# EAGLE design engine_controller (EAGLE 5.06)
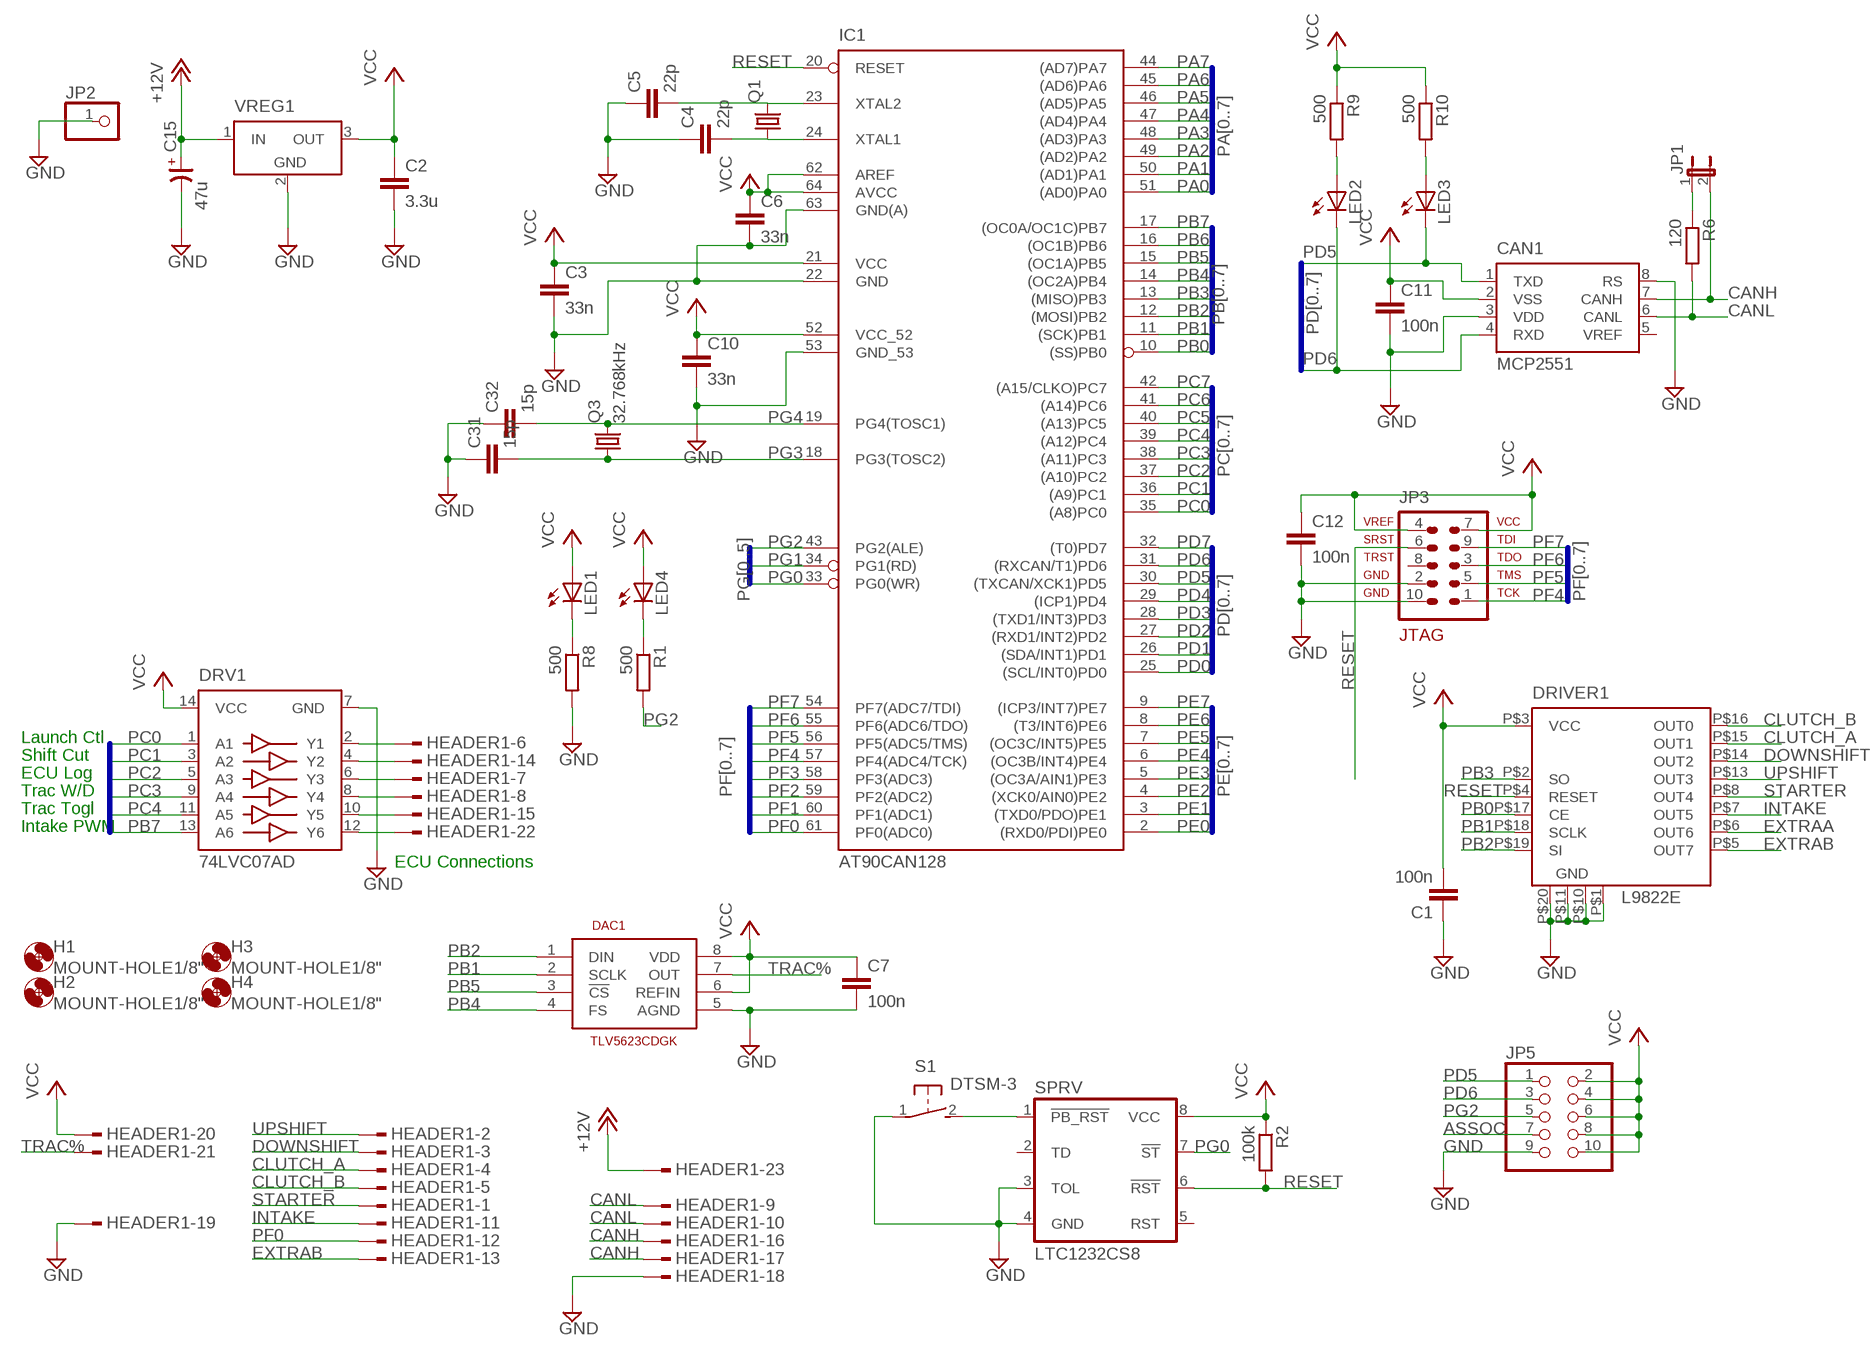
[diagram p0: schematic, sheet 1]

## Parts
C1  100n  C-EUC1206  [C1206]
C2  3.3u  C-EUC1206  [C1206]
C3  33n  C-EUC1206  [C1206]
C4  22p  C-EUC1206  [C1206]
C5  22p  C-EUC1206  [C1206]
C6  33n  C-EUC1206  [C1206]
C7  100n  C-EUC1206  [C1206]
C10  33n  C-EUC1206  [C1206]
C11  100n  C-EUC1206  [C1206]
C12  100n  C-EUC1206  [C1206]
C15  47u  CP-SV-E/F  [SV-E/F]
C31  15p  C-EUC1206  [C1206]
C32  15p  C-EUC1206  [C1206]
CAN1  MCP2551  [SOIC8]
DAC1  TLV5623CDGK  [MSOP08]
DRIVER1  L9822E  [POWERSO-20-NEW]
DRV1  74LVC07AD  [SO14]
H1  MOUNT-HOLE1/8"  [1/8"]
H2  MOUNT-HOLE1/8"  [1/8"]
H3  MOUNT-HOLE1/8"  [1/8"]
H4  MOUNT-HOLE1/8"  [1/8"]
HEADER1  AMPSEAL23-HEADER  [AMPSEAL23-HEADER]
IC1  AT90CAN128  [TQFP64]
JP1  JP1E  [JP1]
JP2  PINHD-1X1  [1X01]
JP3  AVR-JTAG-10  [AVR-JTAG-10]
JP5  PINHD-2X5  [2X05]
LED1  LEDCHIPLED_1206  [CHIPLED_1206]
LED2  LEDCHIPLED_1206  [CHIPLED_1206]
LED3  LEDCHIPLED_1206  [CHIPLED_1206]
LED4  LEDCHIPLED_1206  [CHIPLED_1206]
Q1  CRYSTALHC49UP  [HC49UP]
Q3  32.768kHz  CRYSTALTC26H  [TC26H]
R1  500  R-EU_R1206  [R1206]
R2  100k  R-EU_R1206  [R1206]
R6  120  R-EU_R1206  [R1206]
R8  500  R-EU_R1206  [R1206]
R9  500  R-EU_R1206  [R1206]
R10  500  R-EU_R1206  [R1206]
S1  DTSM-3  [DTSM-3]
SPRV  LTC1232CS8  [SOIC8]
VREG1  LT1129CST5  [SOT223]

## Nets
+12V: C15.+ HEADER1.23 VREG1.1(IN)
ASSOC: JP5.7
CANH: CAN1.7(CANH) HEADER1.16 HEADER1.17 JP1.2
CANL: CAN1.6(CANL) HEADER1.9 HEADER1.10 R6.2
CLUTCH_A: DRIVER1.P$15(OUT1) HEADER1.4
CLUTCH_B: DRIVER1.P$16(OUT0) HEADER1.5
DOWNSHIFT: DRIVER1.P$14(OUT2) HEADER1.3
EXTRAA: DRIVER1.P$6(OUT6)
EXTRAB: DRIVER1.P$5(OUT7) HEADER1.13
GND: C1.1 C2.2 C3.2 C4.1 C5.1 C6.2 C7.2 C10.2 C11.2 C12.2 C15.- C31.1 C32.1 CAN1.3(VDD) CAN1.8(RS) DAC1.5(AGND) DRIVER1.P$1(GND) DRIVER1.P$10(GND1) DRIVER1.P$11(GND2) DRIVER1.P$20(GND3) DRV1.7(GND) HEADER1.18 HEADER1.19 IC1.22(GND) IC1.53(GND_53) IC1.63(GND(A)) JP2.1 JP3.2 JP3.10 JP5.9 R8.2 S1.1 SPRV.3(TOL) SPRV.4(GND) VREG1.2(GND)
INTAKE: DRIVER1.P$7(OUT5) HEADER1.11
N$1: LED4.C R1.1
N$2: DRV1.2(Y1) HEADER1.6
N$3: DRV1.4(Y2) HEADER1.14
N$4: C5.2 IC1.23(XTAL2) Q1.2
N$5: C4.2 IC1.24(XTAL1) Q1.1
N$6: DRV1.6(Y3) HEADER1.7
N$7: DRV1.8(Y4) HEADER1.8
N$8: DRV1.10(Y5) HEADER1.15
N$9: DRV1.12(Y6) HEADER1.22
N$18: S1.2 SPRV.1(!PB_RST)
N$19: JP1.1 R6.1
N$20: LED1.C R8.1
N$21: LED2.A R9.2
N$23: LED3.A R10.2
PA0: IC1.51((AD0)PA0)
PA1: IC1.50((AD1)PA1)
PA2: IC1.49((AD2)PA2)
PA3: IC1.48((AD3)PA3)
PA4: IC1.47((AD4)PA4)
PA5: IC1.46((AD5)PA5)
PA6: IC1.45((AD6)PA6)
PA7: IC1.44((AD7)PA7)
PB0: DRIVER1.P$17(CE) IC1.10((SS)PB0)
PB1: DAC1.2(SCLK) DRIVER1.P$18(SCLK) IC1.11((SCK)PB1)
PB2: DAC1.1(DIN) DRIVER1.P$19(SI) IC1.12((MOSI)PB2)
PB3: DRIVER1.P$2(SO) IC1.13((MISO)PB3)
PB4: DAC1.4(FS) IC1.14((OC2A)PB4)
PB5: DAC1.3(!CS) IC1.15((OC1A)PB5)
PB6: IC1.16((OC1B)PB6)
PB7: DRV1.13(A6) IC1.17((OC0A/OC1C)PB7)
PC0: DRV1.1(A1) IC1.35((A8)PC0)
PC1: DRV1.3(A2) IC1.36((A9)PC1)
PC2: DRV1.5(A3) IC1.37((A10)PC2)
PC3: DRV1.9(A4) IC1.38((A11)PC3)
PC4: DRV1.11(A5) IC1.39((A12)PC4)
PC5: IC1.40((A13)PC5)
PC6: IC1.41((A14)PC6)
PC7: IC1.42((A15/CLKO)PC7)
PD0: IC1.25((SCL/INT0)PD0)
PD1: IC1.26((SDA/INT1)PD1)
PD2: IC1.27((RXD1/INT2)PD2)
PD3: IC1.28((TXD1/INT3)PD3)
PD4: IC1.29((ICP1)PD4)
PD5: CAN1.1(TXD) IC1.30((TXCAN/XCK1)PD5) JP5.1 LED3.C
PD6: CAN1.4(RXD) IC1.31((RXCAN/T1)PD6) JP5.3 LED2.C
PD7: IC1.32((T0)PD7)
PE0: IC1.2((RXD0/PDI)PE0)
PE1: IC1.3((TXD0/PDO)PE1)
PE2: IC1.4((XCK0/AIN0)PE2)
PE3: IC1.5((OC3A/AIN1)PE3)
PE4: IC1.6((OC3B/INT4)PE4)
PE5: IC1.7((OC3C/INT5)PE5)
PE6: IC1.8((T3/INT6)PE6)
PE7: IC1.9((ICP3/INT7)PE7)
PF0: HEADER1.12 IC1.61(PF0(ADC0))
PF1: IC1.60(PF1(ADC1))
PF2: IC1.59(PF2(ADC2))
PF3: IC1.58(PF3(ADC3))
PF4: IC1.57(PF4(ADC4/TCK)) JP3.1
PF5: IC1.56(PF5(ADC5/TMS)) JP3.5
PF6: IC1.55(PF6(ADC6/TDO)) JP3.3
PF7: IC1.54(PF7(ADC7/TDI)) JP3.9
PG0: IC1.33(PG0(WR)) SPRV.7(!ST)
PG1: IC1.34(PG1(RD))
PG2: IC1.43(PG2(ALE)) JP5.5 R1.2
PG3: C31.2 IC1.18(PG3(TOSC2)) Q3.1
PG4: C32.2 IC1.19(PG4(TOSC1)) Q3.2
RESET: DRIVER1.P$4(RESET) IC1.20(RESET) JP3.6 R2.2 SPRV.6(!RST)
STARTER: DRIVER1.P$8(OUT4) HEADER1.1
TRAC%: DAC1.7(OUT) HEADER1.21
UPSHIFT: DRIVER1.P$13(OUT3) HEADER1.2
VCC: C1.2 C2.1 C3.1 C6.1 C7.1 C10.1 C11.1 C12.1 CAN1.2(VSS) DAC1.6(REFIN) DAC1.8(VDD) DRIVER1.P$3(VCC) DRV1.14(VCC) HEADER1.20 IC1.21(VCC) IC1.52(VCC_52) IC1.62(AREF) IC1.64(AVCC) JP3.4 JP3.7 JP5.2 JP5.4 JP5.6 JP5.8 JP5.10 LED1.A LED4.A R2.1 R9.1 R10.1 SPRV.8(VCC) VREG1.3(OUT)
Unconnected: JP3.8 SPRV.2(TD) SPRV.5(RST)

## Buses
PD[0..7]
PF[0..7]
PE[0..7]
PB[0..7]
PA[0..7]
PC[0..7]
PG[0..5]

## Notes on the sheet
- Launch Ctl
- Shift Cut
- ECU Log
- Trac W/D
- Trac Togl
- Intake PWM
- ECU Connections

## Power pins joined to a net without a drawn wire
GND: VREG1.4(GND)
VREF: CAN1.5(VREF)

## Library data of the parts
C1-C7 C10-C12 C31 C32 = resistor:C-EU: CAPACITOR, European symbol
C15 = cap-master:CP-: POLARIZED CAP
CAN1 = MCP2551:MCP2551
DAC1 = tlv5623:TLV5623: LOW POWER 8-BIT DIGITAL-TO-ANALOG CONVERTERS WITH POWER DOWN
DRIVER1 = st-microelectronics:L9822E: The L9822E is an octal low-side solenoid driver realized in Multipower BCD technology particularly suited for driving lamps, relays and solenoids in automotive environment. The DMOS outputs L9822E has a very low power consumption.
DRV1 = 74LVC:74LVC07A: Hex buffer with open-drain outputs
H1-H4 = holes:MOUNT-HOLE: MOUNTING HOLE with drill center marker
HEADER1 = ampseal:AMPSEAL23-HEADER: HEADER ASSEMBLY, 23 POSITION, SNAP-IN, AMPSEAL
IC1 = at90can128:AT90CAN128
JP1 = jumper:JP1E: JUMPER
JP2 = pinhead:PINHD-1X1: PIN HEADER
JP3 = atmel:AVR-JTAG-10: AVR JTAG Debug/Programming Header
JP5 = pinhead:PINHD-2X5: PIN HEADER
LED1-LED4 = led:LED: LED OSRAM: - CHIPLED LG R971, LG N971, LY N971, LG Q971, LY Q971, LO R971, LY R971 LH N974, LH R974 LS Q976, LO Q976, LY Q976 LO Q996 - Hyper CHIPLED LW Q18S LB Q993, LB Q99A, LB R99A - SideLED LS A670, LO A670, LY A670, LG A670, LP A670 LB A673, LV A673, LT A673, LW A673 LH A674 LY A675 LS A676, LA A676, LO A676, LY A676, LW A676 LS A679, LY A679, LG A679 - Hyper Micro SIDELED® LS Y876, LA Y876, LO Y876, LY Y876 LT Y87S - SmartLED LW L88C, LW L88S LB L89C, LB L89S, LG L890 LS L89K, LO L89K, LY L89K LS L896, LA L896, LO L896, LY L896 - TOPLED LS T670, LO T670, LY T670, LG T670, LP T670 LSG T670, LSP T670, LSY T670, LOP T670, LYG T670 LG T671, LOG T671, LSG T671 LB T673, LV T673, LT T673, LW T673 LH T674 LS T676, LA T676, LO T676, LY T676, LB T676, LH T676, LSB T676, LW T676 LB T67C, LV T67C, LT T67C, LS T67K, LO T67K, LY T67K, LW E67C LS E67B, LA E67B, LO E67B, LY E67B, LB E67C, LV E67C, LT E67C LW T67C LS T679, LY T679, LG T679 LS T770, LO T770, LY T770, LG T770, LP T770 LB T773, LV T773, LT T773, LW T773 LH T774 LS E675, LA E675, LY E675, LS T675 LS T776, LA T776, LO T776, LY T776, LB T776 LHGB T686 LT T68C, LB T68C - Hyper Mini TOPLED® LB M676 - Mini TOPLED Santana® LG M470 LS M47K, LO M47K, LY M47K Source: http://www.osram.convergy.de LUXEON: - LUMILED® LXK2-PW12-R00, LXK2-PW12-S00, LXK2-PW14-U00, LXK2-PW14-V00 LXK2-PM12-R00, LXK2-PM12-S00, LXK2-PM14-U00 LXK2-PE12-Q00, LXK2-PE12-R00, LXK2-PE12-S00, LXK2-PE14-T00, LXK2-PE14-U00 LXK2-PB12-K00, LXK2-PB12-L00, LXK2-PB12-M00, LXK2-PB14-N00, LXK2-PB14-P00, LXK2-PB14-Q00 LXK2-PR12-L00, LXK2-PR12-M00, LXK2-PR14-Q00, LXK2-PR14-R00 LXK2-PD12-Q00, LXK2-PD12-R00, LXK2-PD12-S00 LXK2-PH12-R00, LXK2-PH12-S00 LXK2-PL12-P00, LXK2-PL12-Q00, LXK2-PL12-R00 Source: www.luxeon.com KINGBRIGHT: KA-3528ASYC Source: www.kingbright.com
Q1 Q3 = crystal:CRYSTAL: CRYSTAL
R1 R2 R6 R8-R10 = resistor:R-EU_: RESISTOR, European symbol
S1 = switch-tact:DTSM-3
SPRV = linear:LTC1232: Microprocessor Supervisory Circuit
VREG1 = linear-technology:LT1129CST5: VOLTAGE REGULATOR with shutdown

## Board
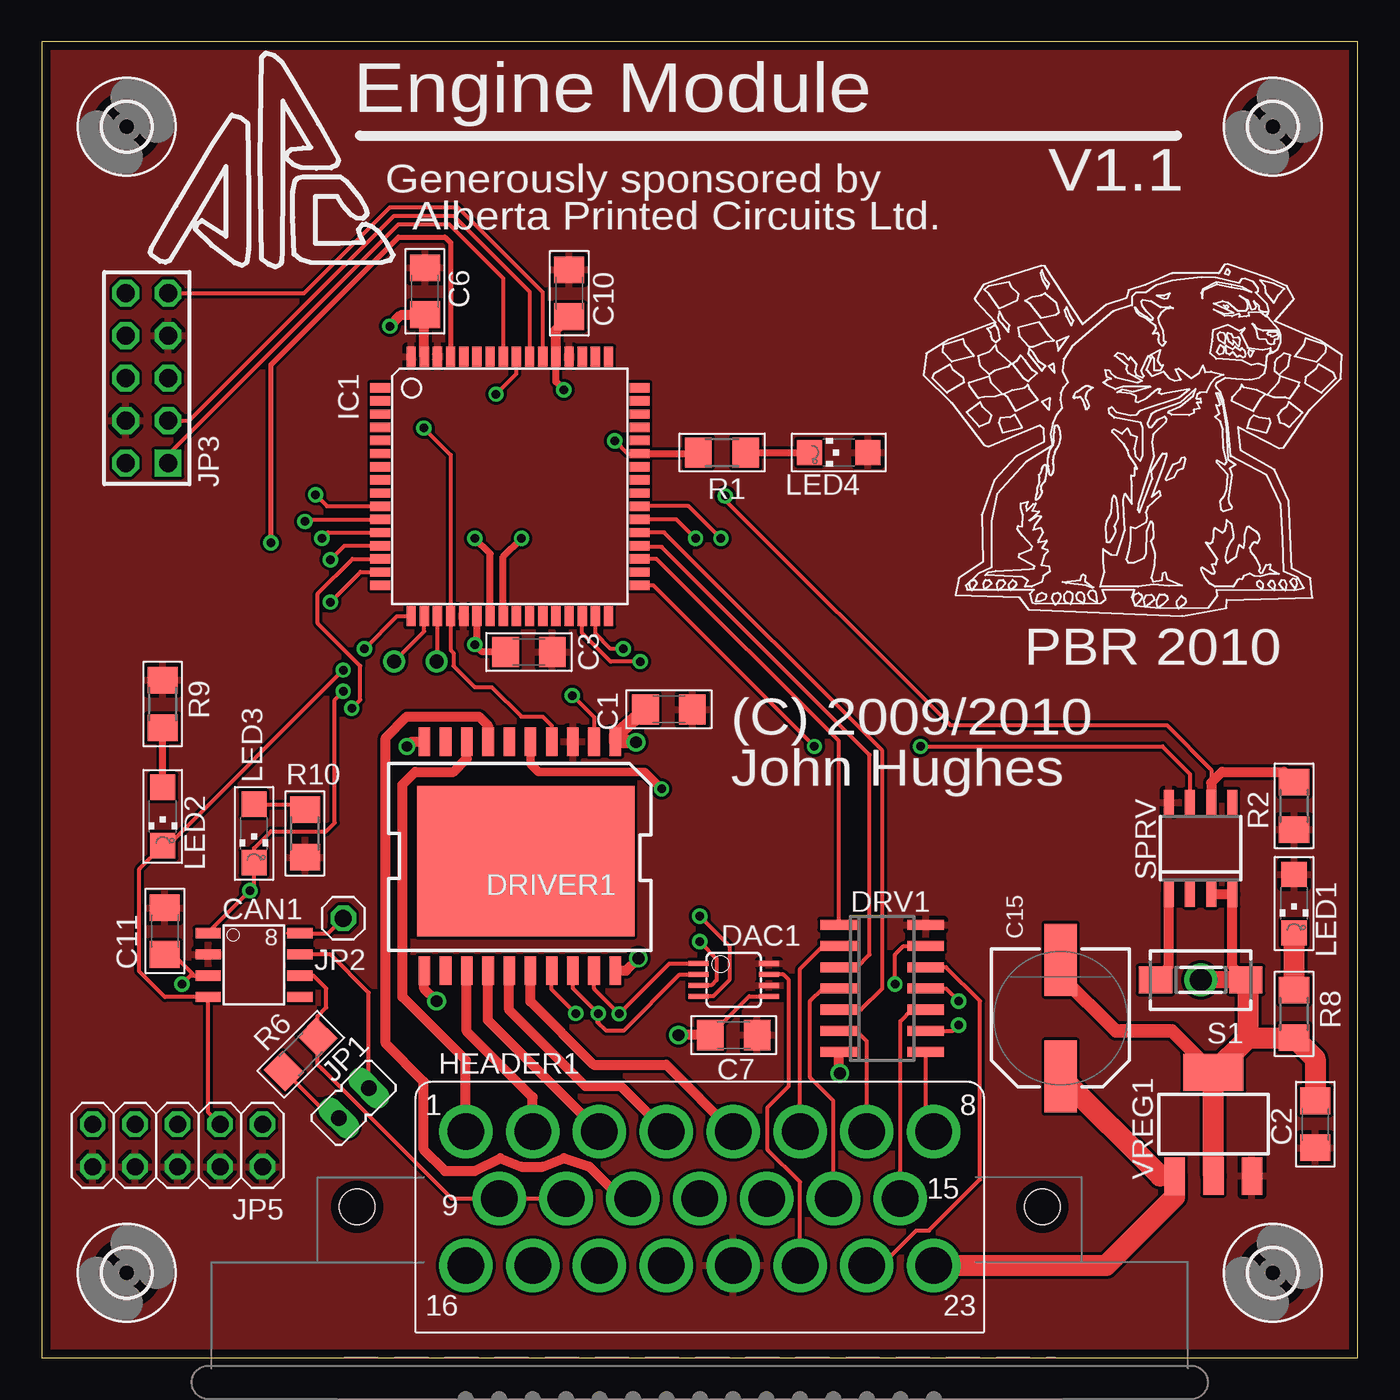
[diagram p1: board, top side]
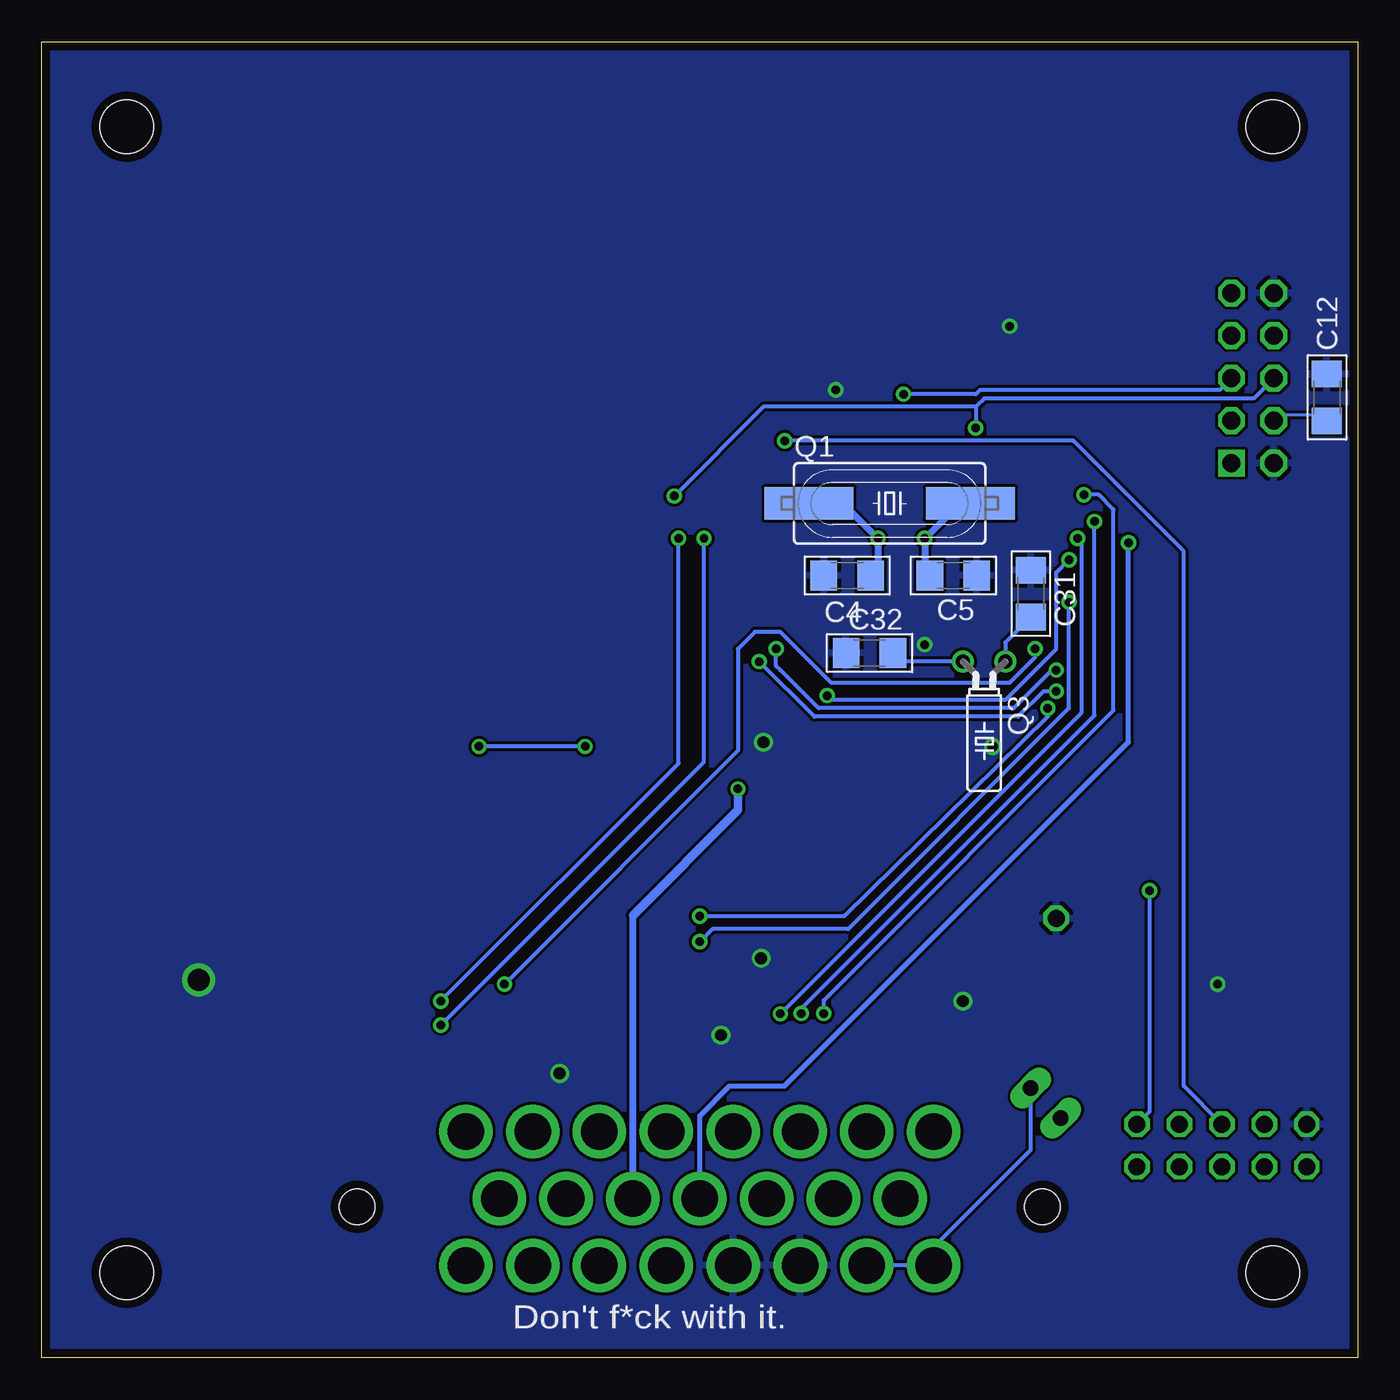
[diagram p2: board, bottom side, seen from below]

Size 78.74 x 78.74 mm. Coordinates in mm from the lower left corner, seen from the top.
Outline: 0,0 78.74,0 78.74,78.74 0,78.74 0,0
Copper layers (1*16): Top 0.035mm / dielectric 1.5mm / Bottom 0.035mm
Design rules "APCircuits": minimum track width 7mil, minimum drill 16mil, track to track 7mil, track to pad 7mil, pad to pad 7mil, via to via 7mil, smd to smd 7mil, copper to edge 20mil, drill to drill 7mil, minimum pad ring 10mil, minimum via ring 8mil, stop-mask expansion 4mil, vias tented up to drill 0mil, thermal gap 10mil

### Footprints (pad centres in the part's own frame; a part is rotated, then mirrored left to right if it is on the bottom)
C1206 = smd 1.6 x 1.8: 1 -1.4,0; 2 1.4,0
SV-E/F = smd 4.318 x 1.93: + -3.493,0; - 3.493,0
SOIC8 = smd 0.61 x 1.524: 1 -2.54,-2.743; 2 -1.27,-2.743; 3 0,-2.743; 4 1.27,-2.743; 5 1.27,2.743; 6 0,2.743; 7 -1.27,2.743; 8 -2.54,2.743
MSOP08 = smd 0.3 x 1.2: 1 -0.976,-2.113; 2 -0.326,-2.113; 3 0.324,-2.113; 4 0.974,-2.113; 5 0.974,2.112; 6 0.324,2.112; 7 -0.326,2.112; 8 -0.976,2.112
POWERSO-20-NEW = smd 0.7 x 1.7: P$1 -2.315,-7.15; P$2 -1.045,-7.15; P$3 0.225,-7.15; P$4 1.495,-7.15; P$5 2.765,-7.15; P$6 4.035,-7.15; P$7 5.305,-7.15; P$8 6.575,-7.15; P$9 7.845,-7.15; P$10 9.115,-7.15; P$11 9.115,6.55; P$12 7.845,6.55; P$13 6.575,6.55; P$14 5.305,6.55; P$15 4.035,6.55; P$16 2.765,6.55; P$17 1.495,6.55; P$18 0.225,6.55; P$19 -1.045,6.55; P$20 -2.315,6.55 | smd 13 x 9: THERMAL 3.05,0
SO14 = smd 0.6 x 2.2: 1 -3.81,-2.6; 2 -2.54,-2.6; 3 -1.27,-2.6; 4 0,-2.6; 5 1.27,-2.6; 6 2.54,-2.6; 7 3.81,-2.6; 8 3.81,2.6; 9 2.54,2.6; 10 1.27,2.6; 11 0,2.6; 12 -1.27,2.6; 13 -2.54,2.6; 14 -3.81,2.6
1/8" = hole 3.175: 0,0
AMPSEAL23-HEADER = drill 2.184 round: 1 -14,4; 2 -10,4; 3 -6,4; 4 -2,4; 5 2,4; 6 6,4; 7 10,4; 8 14,4; 9 -12,0; 10 -8,0; 11 -4,0; 12 0,0; 13 4,0; 14 8,0; 15 12,0; 16 -14,-4; 17 -10,-4; 18 -6,-4; 19 -2,-4; 20 2,-4; 21 6,-4; 22 10,-4; 23 14,-4 | hole 2.108: -20.5,-0.5; 20.5,-0.5
TQFP64 = smd 1.194 x 0.559: 1 -7.76,5.905; 2 -7.76,5.118; 3 -7.76,4.331; 4 -7.76,3.543; 5 -7.76,2.756; 6 -7.76,1.968; 7 -7.76,1.181; 8 -7.76,0.394; 9 -7.76,-0.394; 10 -7.76,-1.181; 11 -7.76,-1.968; 12 -7.76,-2.756; 13 -7.76,-3.543; 14 -7.76,-4.331; 15 -7.76,-5.118; 16 -7.76,-5.905; 33 7.76,-5.905; 34 7.76,-5.118; 35 7.76,-4.331; 36 7.76,-3.543; 37 7.76,-2.756; 38 7.76,-1.968; 39 7.76,-1.181; 40 7.76,-0.394; 41 7.76,0.394; 42 7.76,1.181; 43 7.76,1.968; 44 7.76,2.756; 45 7.76,3.543; 46 7.76,4.331; 47 7.76,5.118; 48 7.76,5.905 | smd 0.559 x 1.194: 17 -5.905,-7.76; 18 -5.118,-7.76; 19 -4.331,-7.76; 20 -3.543,-7.76; 21 -2.756,-7.76; 22 -1.968,-7.76; 23 -1.181,-7.76; 24 -0.394,-7.76; 25 0.394,-7.76; 26 1.181,-7.76; 27 1.968,-7.76; 28 2.756,-7.76; 29 3.543,-7.76; 30 4.331,-7.76; 31 5.118,-7.76; 32 5.905,-7.76; 49 5.905,7.76; 50 5.118,7.76; 51 4.331,7.76; 52 3.543,7.76; 53 2.756,7.76; 54 1.968,7.76; 55 1.181,7.76; 56 0.394,7.76; 57 -0.394,7.76; 58 -1.181,7.76; 59 -1.968,7.76; 60 -2.756,7.76; 61 -3.543,7.76; 62 -4.331,7.76; 63 -5.118,7.76; 64 -5.905,7.76
JP1 = drill 0.914 long: 1 0,-1.27; 2 0,1.27
1X01 = drill 1.016 octagon: 1 0,0
AVR-JTAG-10 = drill 1.067 square: 1 -5.08,-1.27 | drill 1.067 octagon: 2 -5.08,1.27; 3 -2.54,-1.27; 4 -2.54,1.27; 5 0,-1.27; 6 0,1.27; 7 2.54,-1.27; 8 2.54,1.27; 9 5.08,-1.27; 10 5.08,1.27
2X05 = drill 1.016 octagon: 1 -5.08,-1.27; 2 -5.08,1.27; 3 -2.54,-1.27; 4 -2.54,1.27; 5 0,-1.27; 6 0,1.27; 7 2.54,-1.27; 8 2.54,1.27; 9 5.08,-1.27; 10 5.08,1.27
CHIPLED_1206 = smd 1.5 x 1.5: A 0,-1.75; C 0,1.75
HC49UP = smd 5.334 x 1.93: 1 -4.826,0; 2 4.826,0
TC26H = drill 0.813 round: 1 -1.27,0; 2 1.27,0
R1206 = smd 1.6 x 1.803: 1 -1.422,0; 2 1.422,0
DTSM-3 = smd 2 x 1.6: 1 -2.7,0; 2 2.7,0
SOIC8' = smd 0.6 x 1.5: 1 -1.905,-2.75; 2 -0.635,-2.75; 3 0.635,-2.75; 4 1.905,-2.75; 5 1.905,2.75; 6 0.635,2.75; 7 -0.635,2.75; 8 -1.905,2.75
SOT223 = smd 1.219 x 2.235: 1 -2.311,-3.099; 2 0,-3.099; 3 2.311,-3.099 | smd 3.6 x 2.2: 4 0,3.099

### Placement (x,y rotation side)
C1  37.53,38.8 0 top
C2  76.2,13.97 90 top
C3  29.14,42.23 180 top
C4  30.55,46.8 0 bottom
C5  24.2,46.8 180 bottom
C6  22.92,63.81 270 top
C7  41.4,19.3 180 top
C10  31.56,63.69 270 top
C11  7.37,25.53 270 top
C12  1.84,57.47 90 bottom
C15  60.96,20.32 90 top
C31  19.56,45.72 270 bottom
C32  29.21,42.16 0 bottom
CAN1  12.7,22.86 270 top
DAC1  41.4,22.61 270 top
DRIVER1  32,29.72 180 top
DRV1  50.29,22.1 270 top
H1  5.08,5.08 0 top
H2  73.66,5.08 0 top
H3  5.08,73.66 0 top
H4  73.66,73.66 0 top
HEADER1  39.37,9.53 0 top
IC1  28.01,52.13 0 top
JP1  18.67,15.24 315 top
JP2  18.03,26.29 180 top
JP3  6.29,58.61 90 top
JP5  8.13,12.7 180 top
LED1  74.93,27.18 180 top
LED2  7.24,32.38 180 top
LED3  12.7,31.37 180 top
LED4  47.69,54.17 90 top
Q1  28.01,51.12 0 bottom
Q3  22.35,41.66 180 bottom
R1  40.71,54.17 180 top
R2  74.93,33.02 90 top
R6  15.49,18.16 45 top
R8  74.93,20.57 270 top
R9  7.24,39.12 270 top
R10  15.75,31.37 90 top
S1  69.34,22.61 180 top
SPRV  LTC1232CS8  [SOIC8']  69.34,30.48 0 top
VREG1  70.1,13.97 0 top

### Tracks (layer width: path | path; a pad name or v marks a point on that pad's centre or on a via)
+12V
  Top 1.27: HEADER1.23 63.69,5.53 67.79,9.63 VREG1.1 66.92,10.87 C15.+
CANH
  Top 0.254: JP1.2 19.57,21.84 17.27,24.13 CAN1.7
  Bottom 0.254: JP1.2 19.57,12.44 25.37,6.63 HEADER1.16 HEADER1.17
CANL
  Top 0.254: CAN1.6 16.26,22.86 17.02,22.1 17.02,20.95 16.5,20.44 R6.2 16.5,17.54 16.76,17.27 24.51,9.53 HEADER1.9 HEADER1.10
CLUTCH_A
  Top 0.61: DRIVER1.P$15 27.97,20.8 32.51,16.26 34.64,16.26 HEADER1.4
CLUTCH_B
  Top 0.61: DRIVER1.P$16 29.24,21.31 33.02,17.53 37.37,17.53 HEADER1.5
DOWNSHIFT
  Top 0.61: DRIVER1.P$14 26.7,20.2 HEADER1.3
EXTRAB  (via drill 0.51)
  Top 0.508: DRIVER1.P$5 29.24,35.53 29.72,35.05 36.07,35.05 v37.08,34.04
  Bottom 0.406: HEADER1.13 43.37,26.48
  Bottom 0.508: v37.08,34.04 37.08,32.77 43.37,26.48
GND  (via drill 0.51, 0.51 pad 0.61, 0.6 pad 0.61, 0.71, 1.32)
  Top 0.254: DAC1.5 42.33,21.63 C7.2 | JP2.1 17.14,25.4 CAN1.8 14.73,25.4 | 9.14,22.86 8.89,22.86 v8.38,22.35 | 9.14,22.86 CAN1.3 | C11.2 7.88,24.13 9.14,22.86
  Top 0.406: IC1.53 30.76,58.39 v31.24,57.91 | IC1.22 26.04,42.8 v25.91,42.67 26.35,42.23 C3.2
  Top 0.61: DRIVER1.P$20 34.97,23.17 v35.7,23.9 | DRV1.7 47.69,17.33 v47.75,17.02 | S1.1 71.25,23.4 SPRV.4 SPRV.3 | DRIVER1.P$10 22.14,36.87 v21.84,36.58 | C10.2 30.76,61.49 IC1.53 | DRIVER1.P$11 22.89,22.07 v23.62,21.34 | C7.2 v38.1,19.3 | IC1.63 22.89,62.38 | 22.89,62.38 C6.2 | 22.89,62.38 21.48,62.38 v20.83,61.72
  Top 0.813: v35.56,36.83 35.01,36.87 DRIVER1.P$1 34.32,37.23 C1.1 | C15.- 60.96,22.86 64.26,19.56 67.61,19.56 VREG1.4
  Top 1.016: v69.34,22.61 71.68,22.61 72.19,22.1
  Top 1.27: VREG1.2 VREG1.4 72.19,19.15 | 72.19,19.15 R8.2 76.2,17.88 C2.2 | 72.19,19.15 72.19,22.1 72.19,22.46 S1.1
  pour Bottom: 0,78.74 78.74,78.74 78.74,0 0,0
INTAKE
  Top 0.61: DRIVER1.P$7 26.7,37.82 26.16,38.35 21.84,38.35 20.57,37.08 20.57,18.8 22.86,16.51 22.86,12.45 24.13,11.18 25.91,11.18 27.43,11.94 28.7,11.43 29.97,11.43 31.24,11.94 32.77,11.43 34.67,9.53 HEADER1.11
N$1
  Top 0.406: R1.1 LED4.C
N$2
  Top 0.254: HEADER1.6 45.37,23.27 46.74,24.64 DRV1.2
N$3
  Top 0.254: HEADER1.14 47.37,15.37 45.97,16.76 45.97,21.34 46.74,22.1 DRV1.4
N$4  (via drill 0.51)
  Top 0.406: IC1.23 26.82,48.1 v25.91,49.02
  Bottom 0.406: C5.2 25.91,46.35 v25.91,49.02 23.81,51.12 Q1.2
N$5  (via drill 0.51)
  Top 0.406: IC1.24 27.61,47.93 v28.7,49.02
  Bottom 0.406: C4.2 28.7,46.48 v28.7,49.02 30.8,51.12 Q1.1
N$6
  Top 0.254: DRV1.6 48.74,19.56 49.37,18.93 HEADER1.7
N$7
  Top 0.254: DRV1.8 52.89,14 HEADER1.8
N$8
  Top 0.254: HEADER1.15 51.37,20.13 52.07,20.83 DRV1.10
N$9
  Top 0.254: DRV1.12 54.1,23.37 56.13,21.34 56.13,10.67 53.09,7.62 52.32,7.62 50.23,5.53 HEADER1.22
N$18
  Top 0.61: SPRV.1 67.44,23.4 S1.2
N$19
  Top 0.254: R6.1 17.3,14.34
  Top 0.406: 17.3,14.34 JP1.1
N$20
  Top 1.27: R8.1 LED1.C
N$21
  Top 0.406: LED2.A R9.2
N$23
  Top 0.254: LED3.A 14.91,33.12 R10.2
PB0  (via drill 0.51)
  Top 0.254: DRIVER1.P$17 30.51,22.04 v31.95,20.6 | IC1.10 17.07,50.95 v16.39,51.64
  Bottom 0.254: v16.39,51.64 15.49,51.64 14.61,50.75 14.61,38.73 31.95,21.39 v31.95,20.6
PB1  (via drill 0.51)
  Top 0.254: DRIVER1.P$18 31.78,22.11 v33.29,20.6 | 33.29,20.05 33.78,19.56 34.8,19.56 38.17,22.93 DAC1.2 | IC1.11 15.88,50.17 v15.75,50.04
  Top 0.305: 33.29,20.05 v33.29,20.6
  Bottom 0.254: v33.29,20.6 33.29,20.9 15.75,38.44 v15.75,50.04
PB2  (via drill 0.51)
  Top 0.254: IC1.12 17.12,49.38 v16.76,49.02 | DRIVER1.P$19 33.05,22.07 v34.54,20.57 37.55,23.58 DAC1.1
  Bottom 0.254: v34.54,20.57 16.51,38.61 16.51,48.77 v16.76,49.02
PB3  (via drill 0.51)
  Top 0.254: IC1.13 18.11,48.59 v17.27,47.75 | DRIVER1.P$2 33.05,38.33 v31.75,39.62
  Bottom 0.254: v17.27,47.75 18.03,46.99 18.03,42.42 21.08,39.37 31.5,39.37 v31.75,39.62
PB4  (via drill 0.51)
  Top 0.254: DAC1.4 40.17,21.63 41.15,22.61 41.15,24.64 v39.37,26.42 | IC1.14 18.59,47.8 16.51,45.72 16.51,43.94 19.05,41.4 19.05,39.37 v18.54,38.86
  Bottom 0.254: v18.54,38.86 18.54,38.35 30.73,26.42 v39.37,26.42
PB5  (via drill 0.51)
  Top 0.254: DAC1.3 40.06,22.28 40.39,22.61 40.39,23.88 v39.37,24.89 | IC1.15 19.08,47.02 v17.27,45.21
  Bottom 0.254: v17.27,45.21 17.27,38.86 30.48,25.65 38.61,25.65 v39.37,24.89
PB7  (via drill 0.51)
  Top 0.254: DRV1.13 51.56,24.64 51.05,24.13 v51.05,22.35 | IC1.17 21.26,44.37 v19.3,42.42
  Bottom 0.254: v51.05,22.35 37.08,36.32 37.08,42.42 36.07,43.43 34.54,43.43 31.5,40.39 20.83,40.39 19.3,41.91 v19.3,42.42
PC0
  Top 0.254: IC1.35 36.78,47.8 47.69,36.89 DRV1.1
PC1
  Top 0.254: DRV1.3 48.77,23.37 49.53,24.13 49.53,36.07 37.08,48.51 35.84,48.51
  Top 0.406: 35.84,48.51 IC1.36
PC2
  Top 0.254: DRV1.5 49.02,20.83 50.29,22.1 50.29,36.32 37.24,49.38 IC1.37
PC3  (via drill 0.51)
  Top 0.254: IC1.38 37.97,50.17 v39.12,49.02 | DRV1.9 54.5,19.56 v54.85,19.91
  Bottom 0.254: v39.12,49.02 39.12,35.65 v54.85,19.91
PC4  (via drill 0.51)
  Top 0.254: IC1.39 38.71,50.95 v40.64,49.02 | DRV1.11 54.1,22.1 v54.86,21.34
  Bottom 0.254: v40.64,49.02 40.64,35.56 v54.86,21.34
PD5  (via drill 0.51)
  Top 0.254: 10.01,25.5 v12.45,27.94 12.7,28.19 LED3.C 12.7,30.48 13.72,31.5 17.02,31.5 17.53,32 17.53,39.37 v18.03,39.88 | v35.81,41.66 34.04,41.66 32.34,43.35 IC1.30
  Top 0.406: CAN1.1 10.01,25.4 10.01,25.5
  Bottom 0.254: v12.45,27.94 12.45,14.73 JP5.1 | v35.81,41.66 32.51,38.35 20.32,38.35 18.8,39.88 v18.03,39.88
PD6  (via drill 0.51)
  Top 0.254: JP5.3 9.96,14.68 CAN1.4 7.37,21.59 5.84,23.11 5.84,29.24 LED2.C 7.52,30.64 v18.03,41.15 | v34.8,42.42 34.04,42.42 33.12,43.33 IC1.31
  Bottom 0.254: v34.8,42.42 34.8,41.4 34.54,41.15 32.26,38.86 20.57,38.86 18.29,41.15 v18.03,41.15
PF0  (via drill 0.51)
  Top 0.305: IC1.61 24.46,66.72 24.13,67.06 21.34,67.06 13.72,59.44 v13.72,48.77
  Bottom 0.305: v13.72,48.77 13.72,36.83 34.29,16.26 37.59,16.26 39.37,14.48 HEADER1.12
PF4
  Top 0.254: IC1.57 27.61,64.59 24.38,67.82 21.34,67.82 7.56,54.04 JP3.1
PF5  (via drill 0.51)
  Top 0.254: IC1.56 28.4,58.88 v27.18,57.66
  Bottom 0.254: JP3.5 8.26,57.91 22.61,57.91 22.86,57.66 v27.18,57.66
PF6
  Top 0.254: IC1.55 29.19,63.78 24.64,68.33 21.08,68.33 8.83,56.07 JP3.3
PF7
  Top 0.254: IC1.54 29.97,63.75 24.89,68.83 20.83,68.83 15.69,63.69 JP3.9
PG0  (via drill 0.51)
  Top 0.254: IC1.33 36.58,46.23 v46.23,36.58 | v52.58,36.58 67.06,36.58 68.71,34.92 SPRV.7
  Bottom 0.254: v46.23,36.58 v52.58,36.58
PG2  (via drill 0.51)
  Top 0.254: IC1.43 35.05,54.1 v34.29,54.86
  Top 0.406: IC1.43 39.22,54.1 R1.2
  Bottom 0.254: JP5.5 10.41,16.26 10.41,48.26 17.02,54.86 v34.29,54.86
PG3
  Top 0.254: IC1.18 22.89,43.46 Q3.1
  Bottom 0.254: C31.2 21.08,42.8 Q3.1
PG4
  Top 0.254: IC1.19 23.68,41.71 Q3.2
  Bottom 0.254: C32.2 27.3,41.66 Q3.2
RESET  (via drill 0.51, 0.51 pad 0.61)
  Top 0.254: 69.98,34.42 69.98,35.18 67.31,37.85 54.36,37.85 40.89,51.31 v40.89,51.56 | v22.86,55.63 24.46,54.02 IC1.20 24.46,42.34 24.64,42.16 24.64,41.4 25.91,40.13 26.92,40.13 28.7,38.35 29.97,38.35 30.51,37.82 DRIVER1.P$4
  Top 0.61: SPRV.6 69.98,34.42 70.61,35.05 74.32,35.05 R2.2
  Bottom 0.254: JP3.6 6.22,57.4 22.35,57.4 22.86,56.9 | 22.86,56.9 35.56,56.9 v40.89,51.56 | 22.86,56.9 v22.86,55.63
STARTER
  Top 0.61: DRIVER1.P$8 25.43,35.84 24.64,35.05 22.35,35.05 21.59,34.29 21.59,21.59 25.37,17.81 HEADER1.1
TRAC%
  Top 0.254: HEADER1.21 45.37,10.51 43.43,12.45 43.43,14.99 44.7,16.26 44.7,22.61 44.38,22.93 DAC1.7
UPSHIFT
  Top 0.61: DRIVER1.P$13 25.43,19.53 29.37,15.59 HEADER1.2
VCC
  Bottom 0.178: C12.1 2.54,56.39 4.57,56.39 JP3.4
  pour Top: 0,78.74 78.74,78.74 78.74,0 0,0

### Text on the board
tPlace: Engine Module | Generously sponsored by | V1.1 | Alberta Printed Circuits Ltd. | PBR 2010 | (C) 2009/2010 | John Hughes
bPlace: Don't f*ck with it.